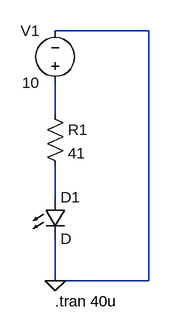
[diagram p0: schematic Part 3.asc]
Part 3.asc, the LTspice schematic file:
Version 4
SHEET 1 880 680
WIRE 352 32 208 32
WIRE 208 160 208 112
WIRE 208 288 208 240
WIRE 208 416 208 352
WIRE 352 416 352 32
WIRE 352 416 208 416
FLAG 208 416 0
SYMBOL voltage 208 128 R180
WINDOW 0 24 96 Left 2
WINDOW 3 24 16 Left 2
WINDOW 123 0 0 Left 0
WINDOW 39 0 0 Left 0
SYMATTR InstName V1
SYMATTR Value 10
SYMBOL res 192 144 R0
SYMATTR InstName R1
SYMATTR Value 41
SYMBOL LED 192 288 R0
SYMATTR InstName D1
TEXT 208 448 Left 2 !.tran 40u

The netlist it stands for:
* Part 3.asc
V1 N001 0 10
R1 N001 N002 41
D1 N002 0 D
.model D D
.lib standard.dio
.tran 40u
.backanno
.end